# EasyEDA Pro project p4-mipi-v1.0.eprj

# Schematic Schematic1
Board Name: Board1; Create Date: 2025-06-03; Page Name: P1; Project Name: p4-mipi-v1.0; Schematic Name: Schematic1; Update Date: 2025-06-03; Company: EasyEDA.com; Page Size: A4; Version: V1.0
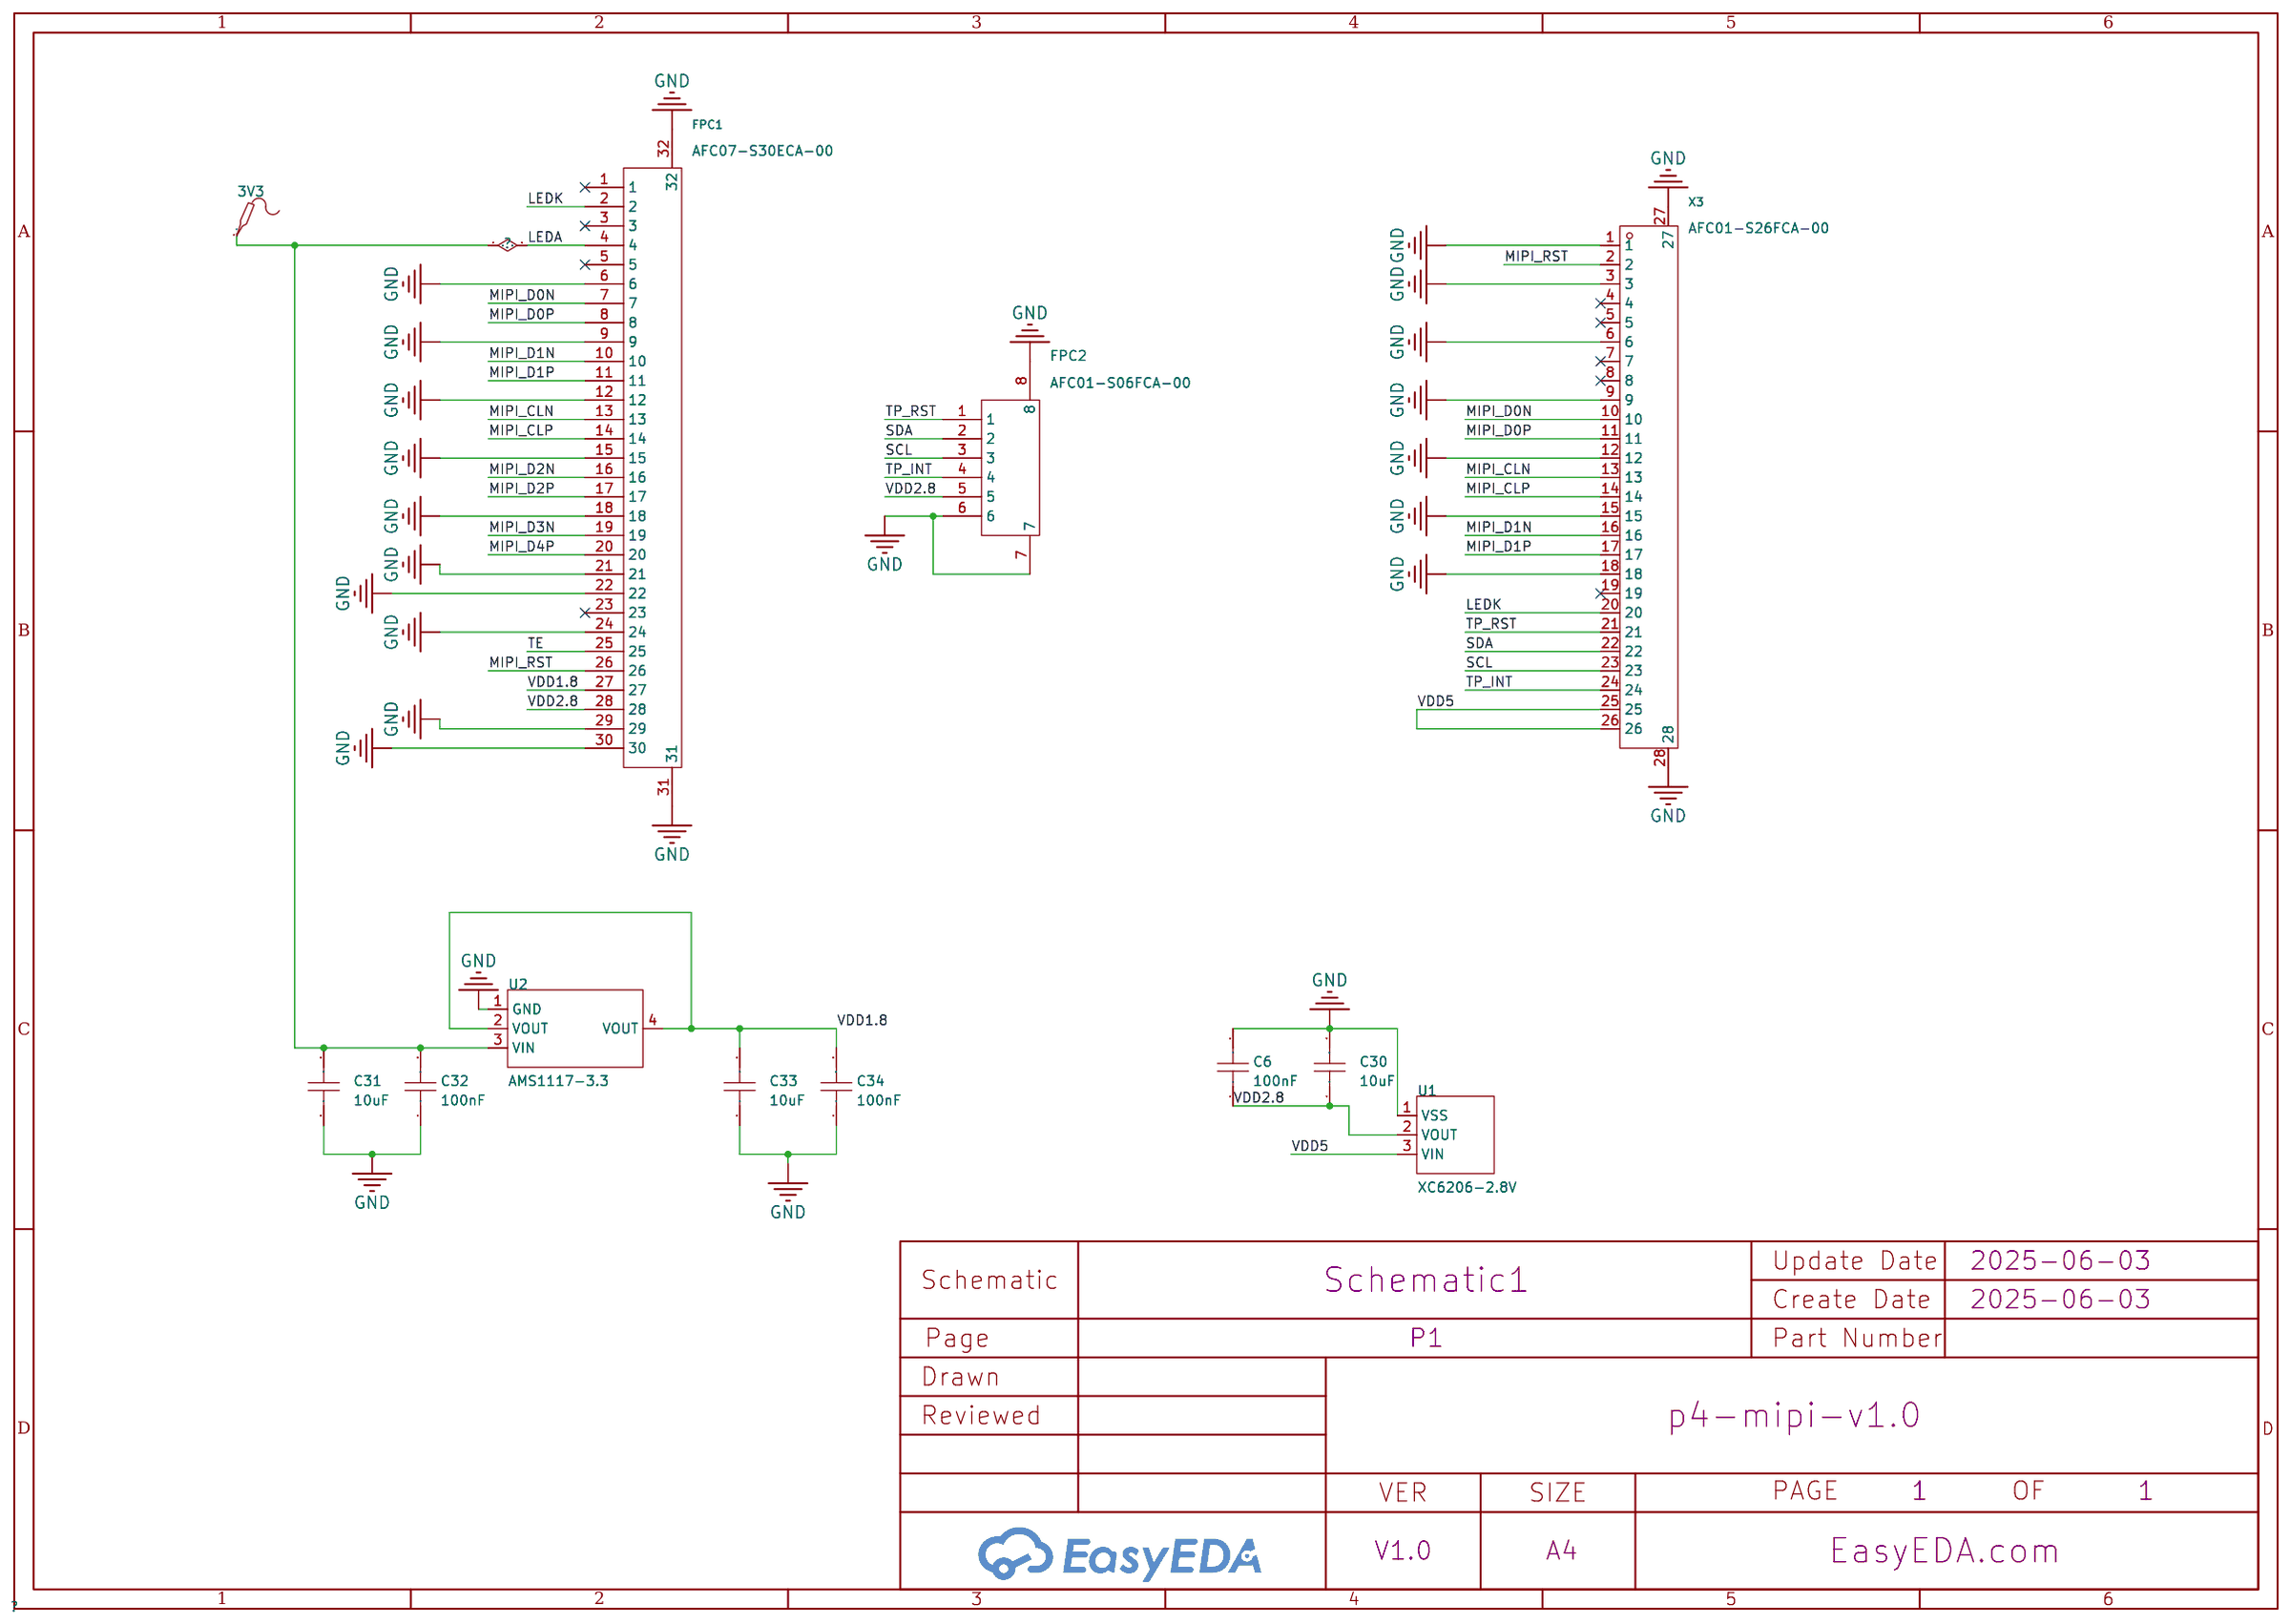
[diagram p0: schematic sheet]

## Parts
3V3  -  [Test-Point-0.5mm]
C6  100nF  [C0402]
C30  10uF  [C0603]
C31  10uF  [C0603]
C32  100nF  [C0402]
C33  10uF  [C0603]
C34  100nF  [C0402]
FPC1  AFC07-S30ECA-00  [FPC-SMD_P0.50-30P_LCS-SJ-H2.0]
FPC2  AFC01-S06FCA-00  [FPC-SMD_P0.50-6P_AFC01-S06FCA-00]
U1  XC6206-2.8V  [SOT-23-3_L2.9-W1.6-P1.90-LS2.8-BR]
U2  AMS1117-3.3  [SOT-223-3_L6.5-W3.4-P2.30-LS7.0-BR]
X3  AFC01-S26FCA-00  [FPC-SMD_AFC01-S26FCA-00]

## Library data of the parts
3V3 = Test-Point
C6 C32 C34 = CL05A105KA5NQNC: Capacitance: Tolerance:±10% Tolerance:±10% Voltage Rated: Temperature Coefficient:; LCSC Part Name: 1uF ±10% 25V; Supplier Part: C52923; Manufacturer: SAMSUNG(三星); Supplier Footprint: 0402; JLCPCB Part Class: Basic Part; Datasheet: https://atta.szlcsc.com/upload/public/pdf/source/20160218/1457707763339.pdf; Supplier: LCSC; Tolerance: ±10%
C30 C31 C33 = CGA0603X5R106K100JT: Capacitance:10uF Tolerance:±10% Tolerance:±10% Voltage Rating:10V Temperature Coefficient:X5R; LCSC Part Name: 10uF ±10% 10V; Supplier Part: C6119842; Manufacturer: HRE(芯声); Supplier Footprint: 0603; JLCPCB Part Class: Extended Part; Supplier: LCSC; Tolerance: ±10%; Voltage Rating: 10V; Temperature Coefficient: X5R
FPC1 = AFC07-S30ECA-00: LCSC Part Name: 间距:0.5mm P数:30P 抽屉式 上接; Supplier Part: C262645; Manufacturer: JS(钜硕电子); Supplier Footprint: SMD,P=0.5mm,卧贴; JLCPCB Part Class: Extended Part; Datasheet: https://atta.szlcsc.com/upload/public/pdf/source/20190726/C11082_A2E7B12387019CE4314BB5199EE0FDF4.pdf; Supplier: LCSC; Locking Feature: 抽屉式; Contact Type: Contact,Top; Number of Contacts: 30P; Pitch: 0.5mm; Mounting Type: 卧贴; FFC, FCB Thickness: 0.3mm; Height Above Board: 2mm
FPC2 = AFC01-S06FCA-00: LCSC Part Name: 间距:0.5mm P数:6P 翻盖式 下接; Supplier Part: C262655; Manufacturer: JS(钜硕电子); Supplier Footprint: SMD,P=0.5mm,卧贴; JLCPCB Part Class: Extended Part; Datasheet: https://atta.szlcsc.com/upload/public/pdf/source/20190816/C413942_2A72D1AC756EAE17EEDF756A339D4500.pdf; Supplier: LCSC; Locking Feature: Clamshell; Contact Type: Bottom Contact; Number of Contacts: 6P; Pitch: 0.5mm; Mounting Type: 卧贴; FFC, FCB Thickness: 0.3mm; Height Above Board: 2mm
U1 = XC6206-2.8V: LCSC Part Name: 输入6V 输出2.8V 250mA; Supplier Part: C2892669; Manufacturer: YONGYUTAI(永裕泰); Supplier Footprint: SOT-23-3L; JLCPCB Part Class: Extended Part; Datasheet: https://atta.szlcsc.com/upload/public/pdf/source/20210901/DE3C77F0CE73FFE8F7C655BE9B94CB06.pdf; Supplier: LCSC; Output Type: Fixed; Voltage - Supply: 6V; Output Voltage: 2.8V; Output Current: 250mA; Features: Short-Circuit  Protection(SCP)；Low ESR；Overcurrent Protection(OCP); Operating Temperature: -40℃~+85℃@(Tj); Output Configuration: Positive electrode; Number of Outputs: 1
U2 = AMS1117-3.3_C6186: LCSC Part Name: 输出3.3V 1A; Supplier Part: C6186; Manufacturer: AMS; Supplier Footprint: SOT-223; Datasheet: https://atta.szlcsc.com/upload/public/pdf/source/20180727/C6186_7A095716F0823C02F1997A905E26C086.pdf; Supplier: LCSC; Output Type: Fixed; Output Voltage: 3.3V; Output Current: 1A; Power Supply Rejection Ratio (PSRR): 72dB@(120Hz); Voltage Dropout: 1.3V@(800mA); Features: Overcurrent Protection(OCP)；热关断(TSD); Output Configuration: Positive electrode; Number of Outputs: 1
X3 = AFC01-S26FCA-00: LCSC Part Name: 间距:0.5mm P数:26P 翻盖式 下接; Supplier Part: C262670; Manufacturer: JS(钜硕电子); Supplier Footprint: SMD,P=0.5mm,卧贴; JLCPCB Part Class: Extended Part; Datasheet: https://atta.szlcsc.com/upload/public/pdf/source/20191211/C262677_316A580FEA155B8CDF2AB479F4C1B0B5.pdf; Supplier: LCSC; Locking Feature: Clamshell; Contact Type: Bottom Contact; Number of Contacts: 26P; Pitch: 0.5mm; Mounting Type: 卧贴; FFC, FCB Thickness: 0.3mm; Height Above Board: 2mm

## Nets
GND: C6.2 C30.2 C31.1 C32.1 C33.1 C34.1 FPC1.6 FPC1.9 FPC1.12 FPC1.15 FPC1.18 FPC1.21 FPC1.22 FPC1.24 FPC1.29 FPC1.30 FPC1.31 FPC1.32 FPC2.6 FPC2.7 FPC2.8 U1.1(VSS) U2.1(GND) X3.1 X3.3 X3.6 X3.9 X3.12 X3.15 X3.18 X3.27 X3.28
VDD1.8: C33.2 C34.2 FPC1.27 U2.2(VOUT) U2.4(VOUT)
VDD2.8: C6.1 C30.1 FPC1.28 FPC2.5 U1.2(VOUT)
VDD5: U1.3(VIN) X3.25 X3.26
LEDA: 3V3.1 C31.2 C32.2 FPC1.4 U2.3(VIN)
LEDK: FPC1.2 X3.20
MIPI_CLN: FPC1.13 X3.13
MIPI_CLP: FPC1.14 X3.14
MIPI_D0N: FPC1.7 X3.10
MIPI_D0P: FPC1.8 X3.11
MIPI_D1N: FPC1.10 X3.16
MIPI_D1P: FPC1.11 X3.17
MIPI_D2N: FPC1.16
MIPI_D2P: FPC1.17
MIPI_D3N: FPC1.19
MIPI_D4P: FPC1.20
MIPI_RST: FPC1.26 X3.2
SCL: FPC2.3 X3.23
SDA: FPC2.2 X3.22
TE: FPC1.25
TP_INT: FPC2.4 X3.24
TP_RST: FPC2.1 X3.21

Not connected (* = marked no-connect by the designer): FPC1 1* 3* 5* 23*; X3 4* 5* 7* 8* 19*

# Schematic Schematic2
Board Name: Board2; Create Date: 2025-07-01; Page Name: P1; Project Name: p4-mipi-v1.0; Schematic Name: Schematic2; Update Date: 2025-07-01; Company: EasyEDA.com; Page Size: A4; Version: V1.0
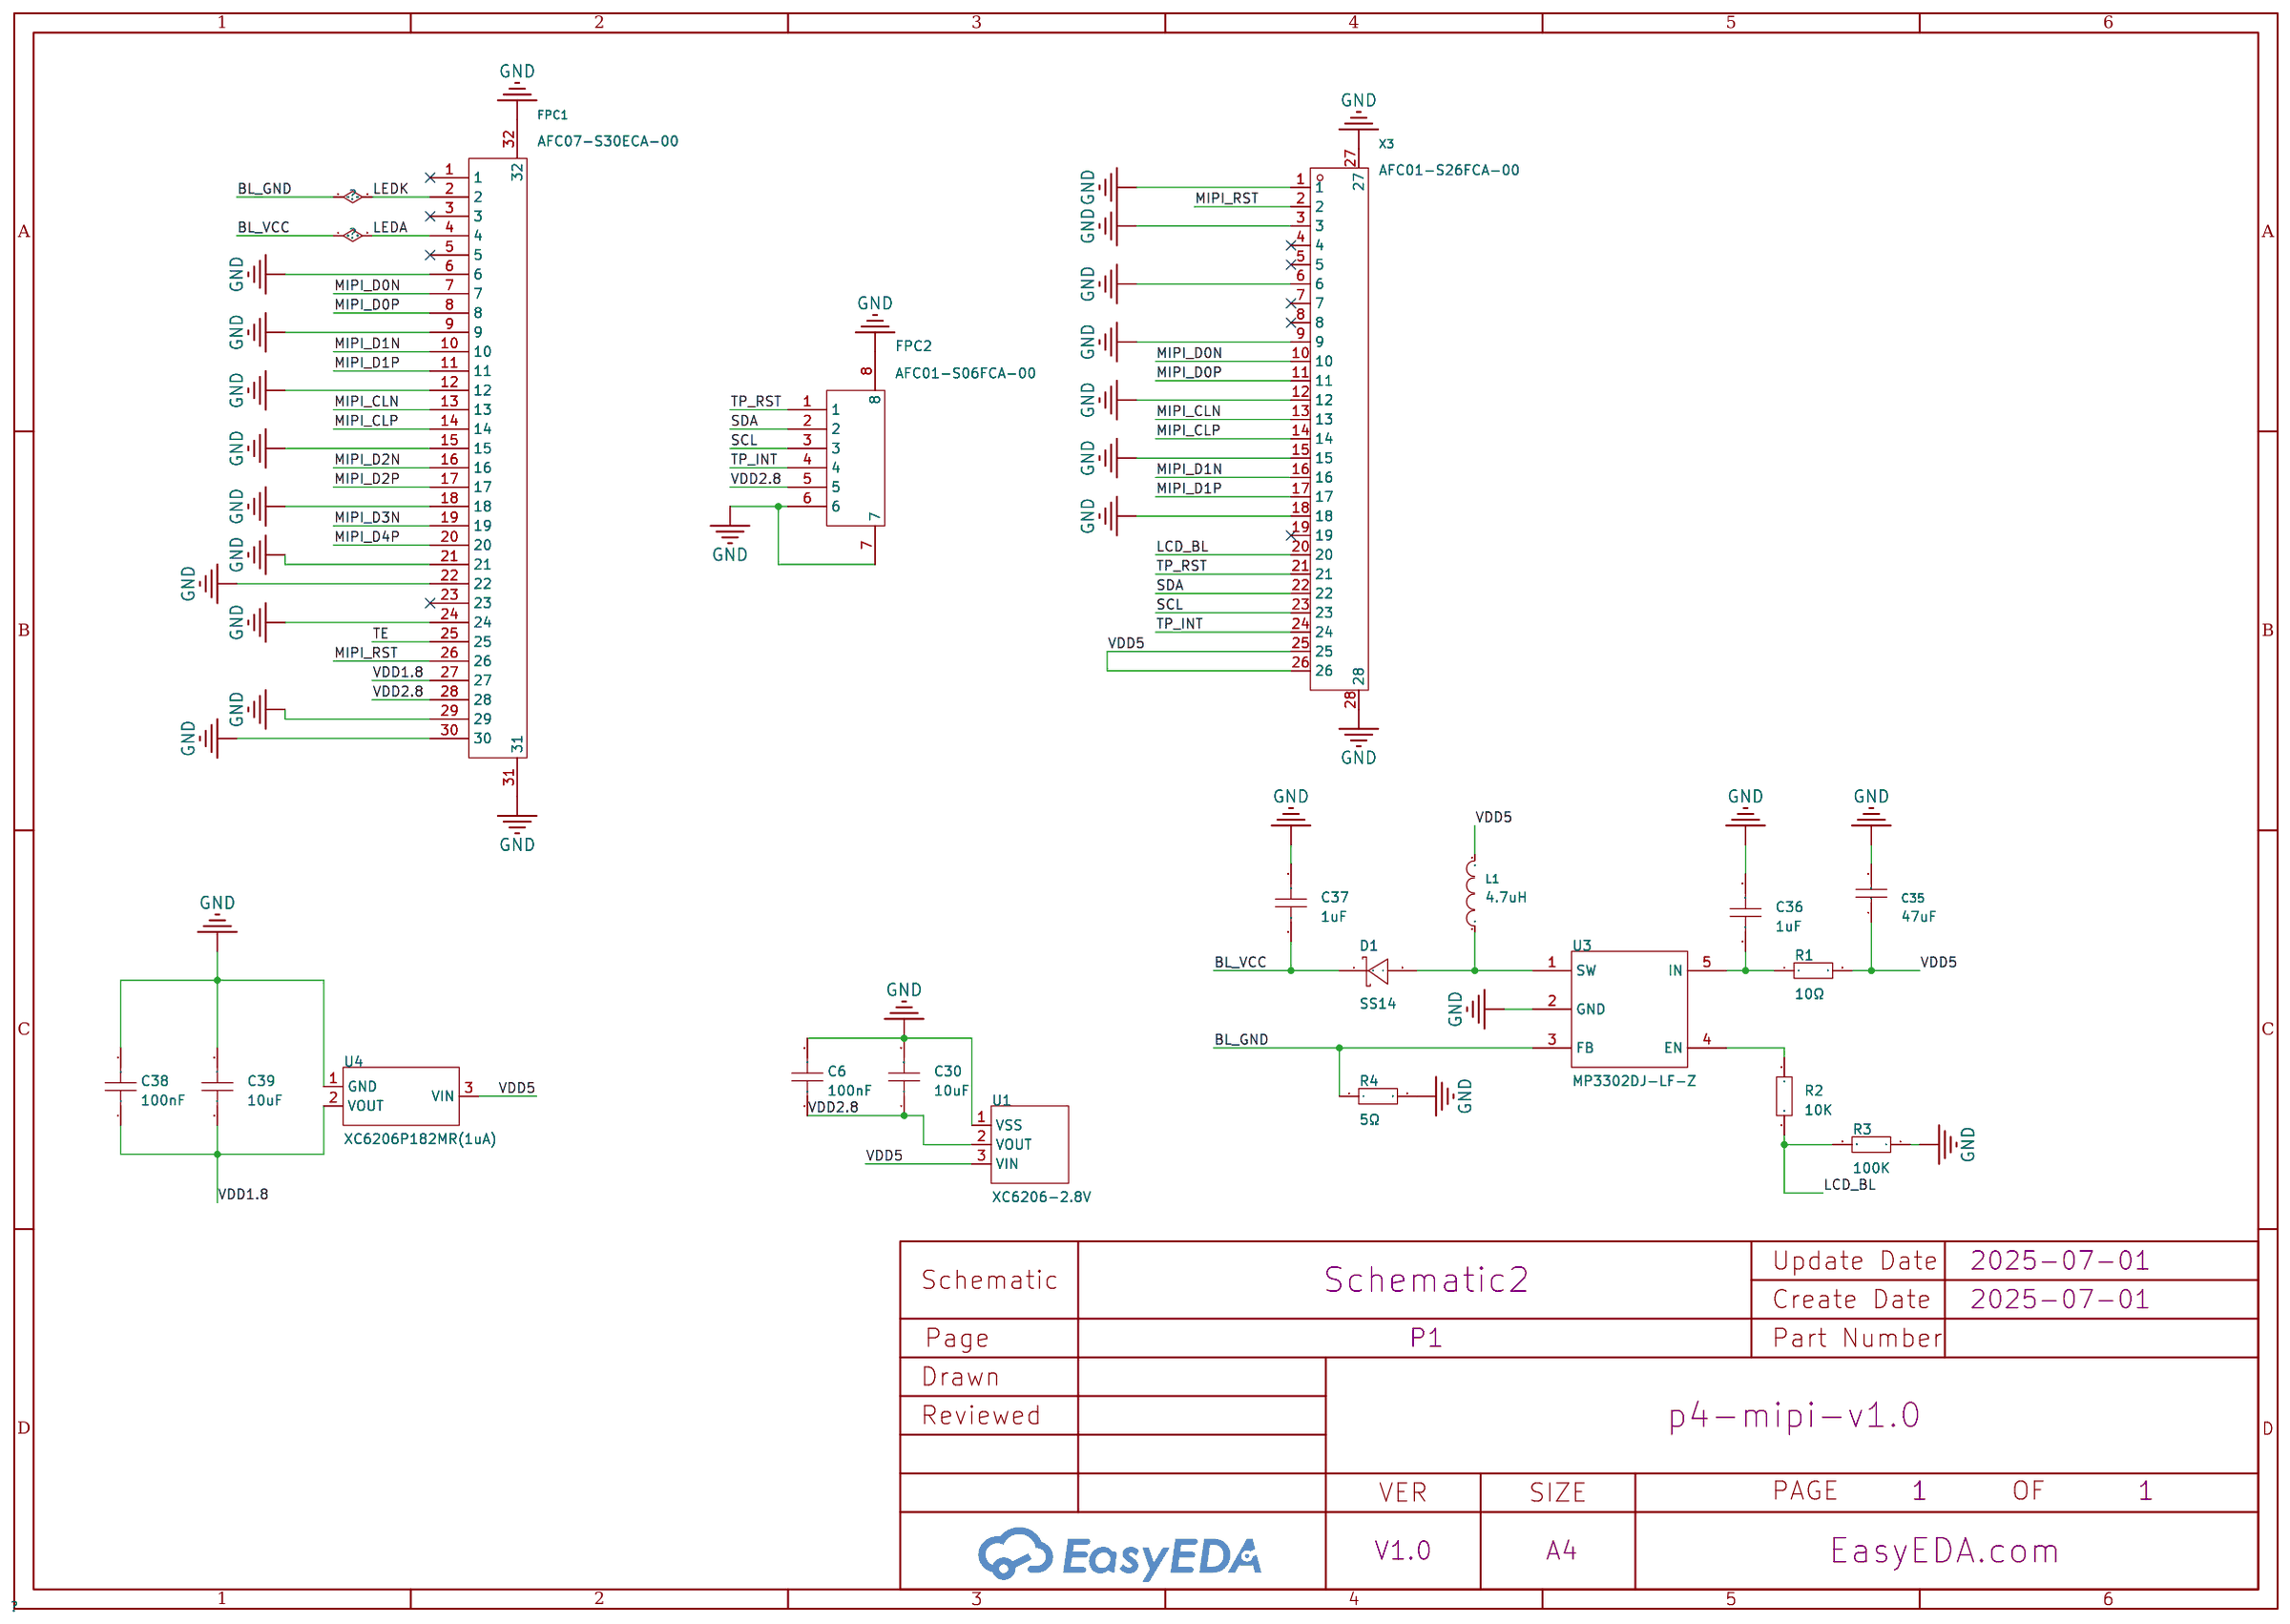
[diagram p1: schematic sheet]

## Parts
C6  100nF  [C0402]
C30  10uF  [C0603]
C35  47uF  [C0603]
C36  1uF  [C0603]
C37  1uF  [C0603]
C38  100nF  [C0402]
C39  10uF  [C0603]
D1  SS14  [SMA_L4.3-W2.6-LS5.2-RD]
FPC1  AFC07-S30ECA-00  [FPC-SMD_P0.50-30P_LCS-SJ-H2.0]
FPC2  AFC01-S06FCA-00  [FPC-SMD_P0.50-6P_AFC01-S06FCA-00]
L1  4.7uH  [IND-SMD_L4.4-W4.2]
R1  10Ω  [R0402]
R2  10K  [R0402]
R3  100K  [R0402]
R4  5Ω  [R0402]
U1  XC6206-2.8V  [SOT-23-3_L2.9-W1.6-P1.90-LS2.8-BR]
U3  MP3302DJ-LF-Z  [SOT-23-5_L3.0-W1.7-P0.95-LS2.8-BR]
U4  XC6206P182MR(1uA)  [SOT-23-3_L2.9-W1.6-P1.90-LS2.8-BR]
X3  AFC01-S26FCA-00  [FPC-SMD_AFC01-S26FCA-00]

## Library data of the parts
C6 C38 = CL05A105KA5NQNC: Capacitance: Tolerance:±10% Tolerance:±10% Voltage Rated: Temperature Coefficient:; LCSC Part Name: 1uF ±10% 25V; Supplier Part: C52923; Manufacturer: SAMSUNG(三星); Supplier Footprint: 0402; JLCPCB Part Class: Basic Part; Datasheet: https://atta.szlcsc.com/upload/public/pdf/source/20160218/1457707763339.pdf; Supplier: LCSC; Tolerance: ±10%
C30 C39 = CGA0603X5R106K100JT: Capacitance:10uF Tolerance:±10% Tolerance:±10% Voltage Rating:10V Temperature Coefficient:X5R; LCSC Part Name: 10uF ±10% 10V; Supplier Part: C6119842; Manufacturer: HRE(芯声); Supplier Footprint: 0603; JLCPCB Part Class: Extended Part; Supplier: LCSC; Tolerance: ±10%; Voltage Rating: 10V; Temperature Coefficient: X5R
C35 = GRM188R60J476ME15D: LCSC Part Name: 47uF ±20% 6.3V; Supplier Part: C140782; Manufacturer: muRata(村田); Supplier Footprint: 0603; JLCPCB Part Class: Extended Part; Datasheet: https://atta.szlcsc.com/upload/public/pdf/source/20171113/C140782_15105612981581115778.pdf; Supplier: LCSC; Tolerance: ±20%
C36 C37 = CL10A105KB8NNNC: LCSC Part Name: 1uF ±10% 50V; Supplier Part: C15849; Manufacturer: SAMSUNG(三星); Supplier Footprint: 0603; JLCPCB Part Class: Basic Part; Datasheet: https://atta.szlcsc.com/upload/public/pdf/source/20160218/1457707763339.pdf; Supplier: LCSC; Tolerance: ±10%
D1 = SS14_C83852: LCSC Part Name: 电压:40V 电流:1A; Supplier Part: C83852; Manufacturer: onsemi(安森美); Supplier Footprint: SMA(DO-214AC); JLCPCB Part Class: Extended Part; Datasheet: https://atta.szlcsc.com/upload/public/pdf/source/20181222/C83852_041FE29A925F1DAA7D9CB1F1C69076C2.pdf; Supplier: LCSC; Forward Voltage (Vf@If): 500mV@1A; Reverse Voltage (Vr): 40V; Rectified Current: 1A; Reverse Leakage Current (Ir): 200uA@40V
FPC1 = AFC07-S30ECA-00: LCSC Part Name: 间距:0.5mm P数:30P 抽屉式 上接; Supplier Part: C262645; Manufacturer: JS(钜硕电子); Supplier Footprint: SMD,P=0.5mm,卧贴; JLCPCB Part Class: Extended Part; Datasheet: https://atta.szlcsc.com/upload/public/pdf/source/20190726/C11082_A2E7B12387019CE4314BB5199EE0FDF4.pdf; Supplier: LCSC; Locking Feature: 抽屉式; Contact Type: Contact,Top; Number of Contacts: 30P; Pitch: 0.5mm; Mounting Type: 卧贴; FFC, FCB Thickness: 0.3mm; Height Above Board: 2mm
FPC2 = AFC01-S06FCA-00: LCSC Part Name: 间距:0.5mm P数:6P 翻盖式 下接; Supplier Part: C262655; Manufacturer: JS(钜硕电子); Supplier Footprint: SMD,P=0.5mm,卧贴; JLCPCB Part Class: Extended Part; Datasheet: https://atta.szlcsc.com/upload/public/pdf/source/20190816/C413942_2A72D1AC756EAE17EEDF756A339D4500.pdf; Supplier: LCSC; Locking Feature: Clamshell; Contact Type: Bottom Contact; Number of Contacts: 6P; Pitch: 0.5mm; Mounting Type: 卧贴; FFC, FCB Thickness: 0.3mm; Height Above Board: 2mm
L1 = SLO0420H4R7MTT: LCSC Part Name: 4.7uH ±20%; Supplier Part: C207830; Manufacturer: Sunltech(韩国顺磁); Supplier Footprint: SMD; JLCPCB Part Class: Extended Part; Datasheet: https://atta.szlcsc.com/upload/public/pdf/source/20180412/C207832_AC02695E18CA38D7B5E2858AA75468CE.pdf; Supplier: LCSC; Tolerance: ±20%
R1-R4 = RC0402FR-0710RL: LCSC Part Name: 厚膜电阻 10Ω ±1% 62.5mW; Supplier Part: C138066; Manufacturer: YAGEO(国巨); Supplier Footprint: 0402; JLCPCB Part Class: Extended Part; Datasheet: https://atta.szlcsc.com/upload/public/pdf/source/20181009/C309620_DA5935B6E1D48212CB7A533FE518B3C2.pdf; Supplier: LCSC; Type: Thick Film Resistors; Tolerance: ±1%; Temperature Coefficient: ±200ppm/℃; Operating Temperature Range: -55℃~+155℃
U1 = XC6206-2.8V: LCSC Part Name: 输入6V 输出2.8V 250mA; Supplier Part: C2892669; Manufacturer: YONGYUTAI(永裕泰); Supplier Footprint: SOT-23-3L; JLCPCB Part Class: Extended Part; Datasheet: https://atta.szlcsc.com/upload/public/pdf/source/20210901/DE3C77F0CE73FFE8F7C655BE9B94CB06.pdf; Supplier: LCSC; Output Type: Fixed; Voltage - Supply: 6V; Output Voltage: 2.8V; Output Current: 250mA; Features: Short-Circuit  Protection(SCP)；Low ESR；Overcurrent Protection(OCP); Operating Temperature: -40℃~+85℃@(Tj); Output Configuration: Positive electrode; Number of Outputs: 1
U3 = MP3302DJ-LF-Z: Supplier Part: C15035; Manufacturer: MPS(芯源); Supplier Footprint: TSOT-23-5; JLCPCB Part Class: Extended Part; Datasheet: https://atta.szlcsc.com/upload/public/pdf/source/20240514/2E39C2A006245A2119E00EF19DA2BC3B.pdf; Supplier: LCSC; Type: DC-DCVoltage Stabilizer; Input Voltage: 2.5V~6V; Switch Frequency: 1.3MHz; Channels: 1; Output Voltage: 36V; Output Current: 1.33A; Dimming: Single Wire; Topology: boost converter; Operating temperature: -40℃~+125℃
U4 = XC6206P182MR(1uA): Supplier Part: C2827651; Manufacturer: TECH PUBLIC(台舟); Supplier Footprint: SOT-23-3L; JLCPCB Part Class: Extended Part; Datasheet: https://atta.szlcsc.com/upload/public/pdf/source/20210427/C2827651_CB3194A7C09679308DE708B038C8109A.pdf; Supplier: LCSC; Output Type: Fixed; Output Voltage: 1.8V; Output Current: 200mA; standby current: 1uA; Features: Overcurrent Protection(OCP)；过热关断(TSD)(OTP); Output Configuration: Positive electrode; Number of Outputs: 1
X3 = AFC01-S26FCA-00: LCSC Part Name: 间距:0.5mm P数:26P 翻盖式 下接; Supplier Part: C262670; Manufacturer: JS(钜硕电子); Supplier Footprint: SMD,P=0.5mm,卧贴; JLCPCB Part Class: Extended Part; Datasheet: https://atta.szlcsc.com/upload/public/pdf/source/20191211/C262677_316A580FEA155B8CDF2AB479F4C1B0B5.pdf; Supplier: LCSC; Locking Feature: Clamshell; Contact Type: Bottom Contact; Number of Contacts: 26P; Pitch: 0.5mm; Mounting Type: 卧贴; FFC, FCB Thickness: 0.3mm; Height Above Board: 2mm

## Nets
GND: C6.2 C30.2 C35.2 C36.2 C37.2 C38.2 C39.2 FPC1.6 FPC1.9 FPC1.12 FPC1.15 FPC1.18 FPC1.21 FPC1.22 FPC1.24 FPC1.29 FPC1.30 FPC1.31 FPC1.32 FPC2.6 FPC2.7 FPC2.8 R3.1 R4.2 U1.1(VSS) U3.2(GND) U4.1(GND) X3.1 X3.3 X3.6 X3.9 X3.12 X3.15 X3.18 X3.27 X3.28
VDD1.8: C38.1 C39.1 FPC1.27 U4.2(VOUT)
VDD2.8: C6.1 C30.1 FPC1.28 FPC2.5 U1.2(VOUT)
VDD5: C35.1 L1.2 R1.2 U1.3(VIN) U4.3(VIN) X3.25 X3.26
BL_GND: FPC1.2 R4.1 U3.3(FB)
BL_VCC: C37.1 D1.1(K) FPC1.4
LCD_BL: R2.1 R3.2 X3.20
MIPI_CLN: FPC1.13 X3.13
MIPI_CLP: FPC1.14 X3.14
MIPI_D0N: FPC1.7 X3.10
MIPI_D0P: FPC1.8 X3.11
MIPI_D1N: FPC1.10 X3.16
MIPI_D1P: FPC1.11 X3.17
MIPI_D2N: FPC1.16
MIPI_D2P: FPC1.17
MIPI_D3N: FPC1.19
MIPI_D4P: FPC1.20
MIPI_RST: FPC1.26 X3.2
SCL: FPC2.3 X3.23
SDA: FPC2.2 X3.22
TE: FPC1.25
TP_INT: FPC2.4 X3.24
TP_RST: FPC2.1 X3.21
$1N1393: C36.1 R1.1 U3.5(IN)
$1N1536: R2.2 U3.4(EN)
$1N1811: D1.2(A) L1.1 U3.1(SW)

Not connected (* = marked no-connect by the designer): FPC1 1* 3* 5* 23*; X3 4* 5* 7* 8* 19*

# Board PCB1
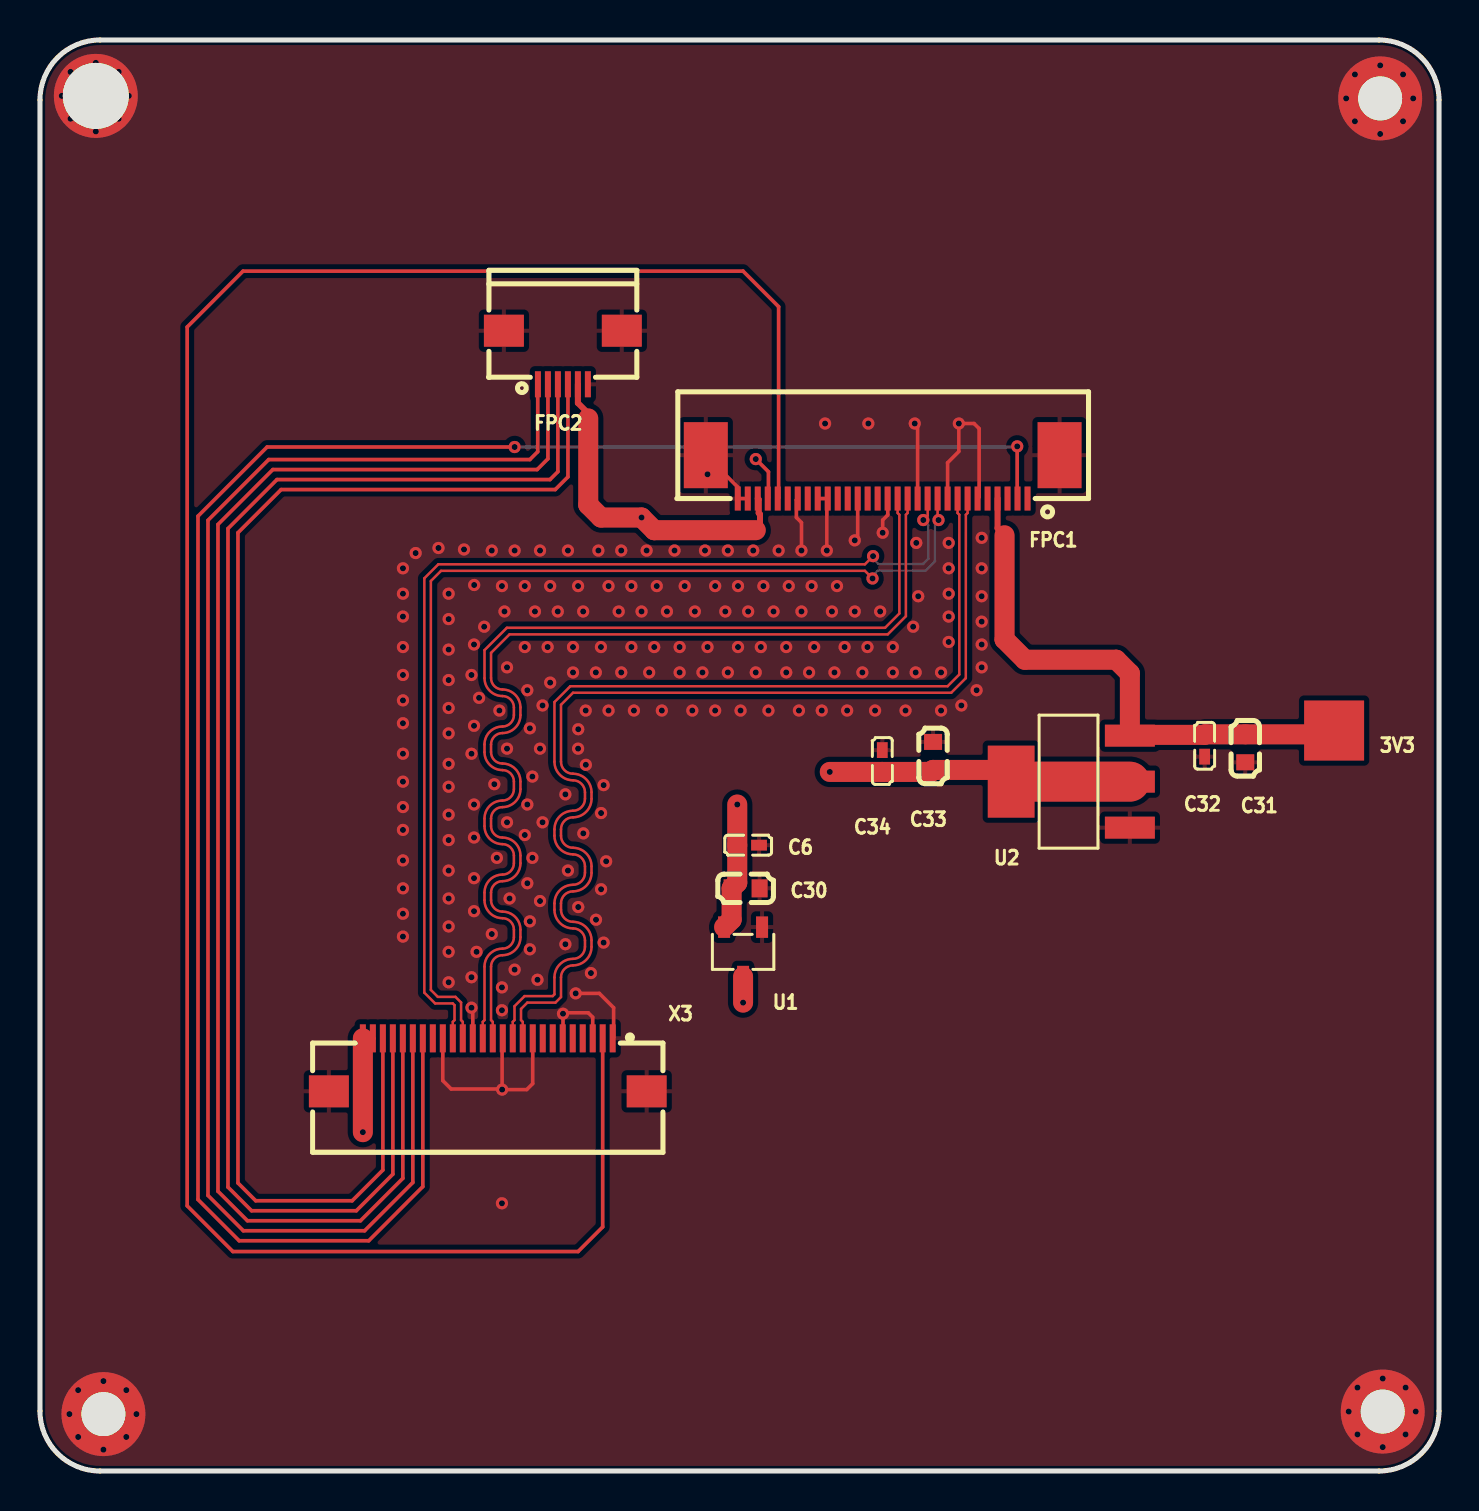
[diagram p2: board, top side]
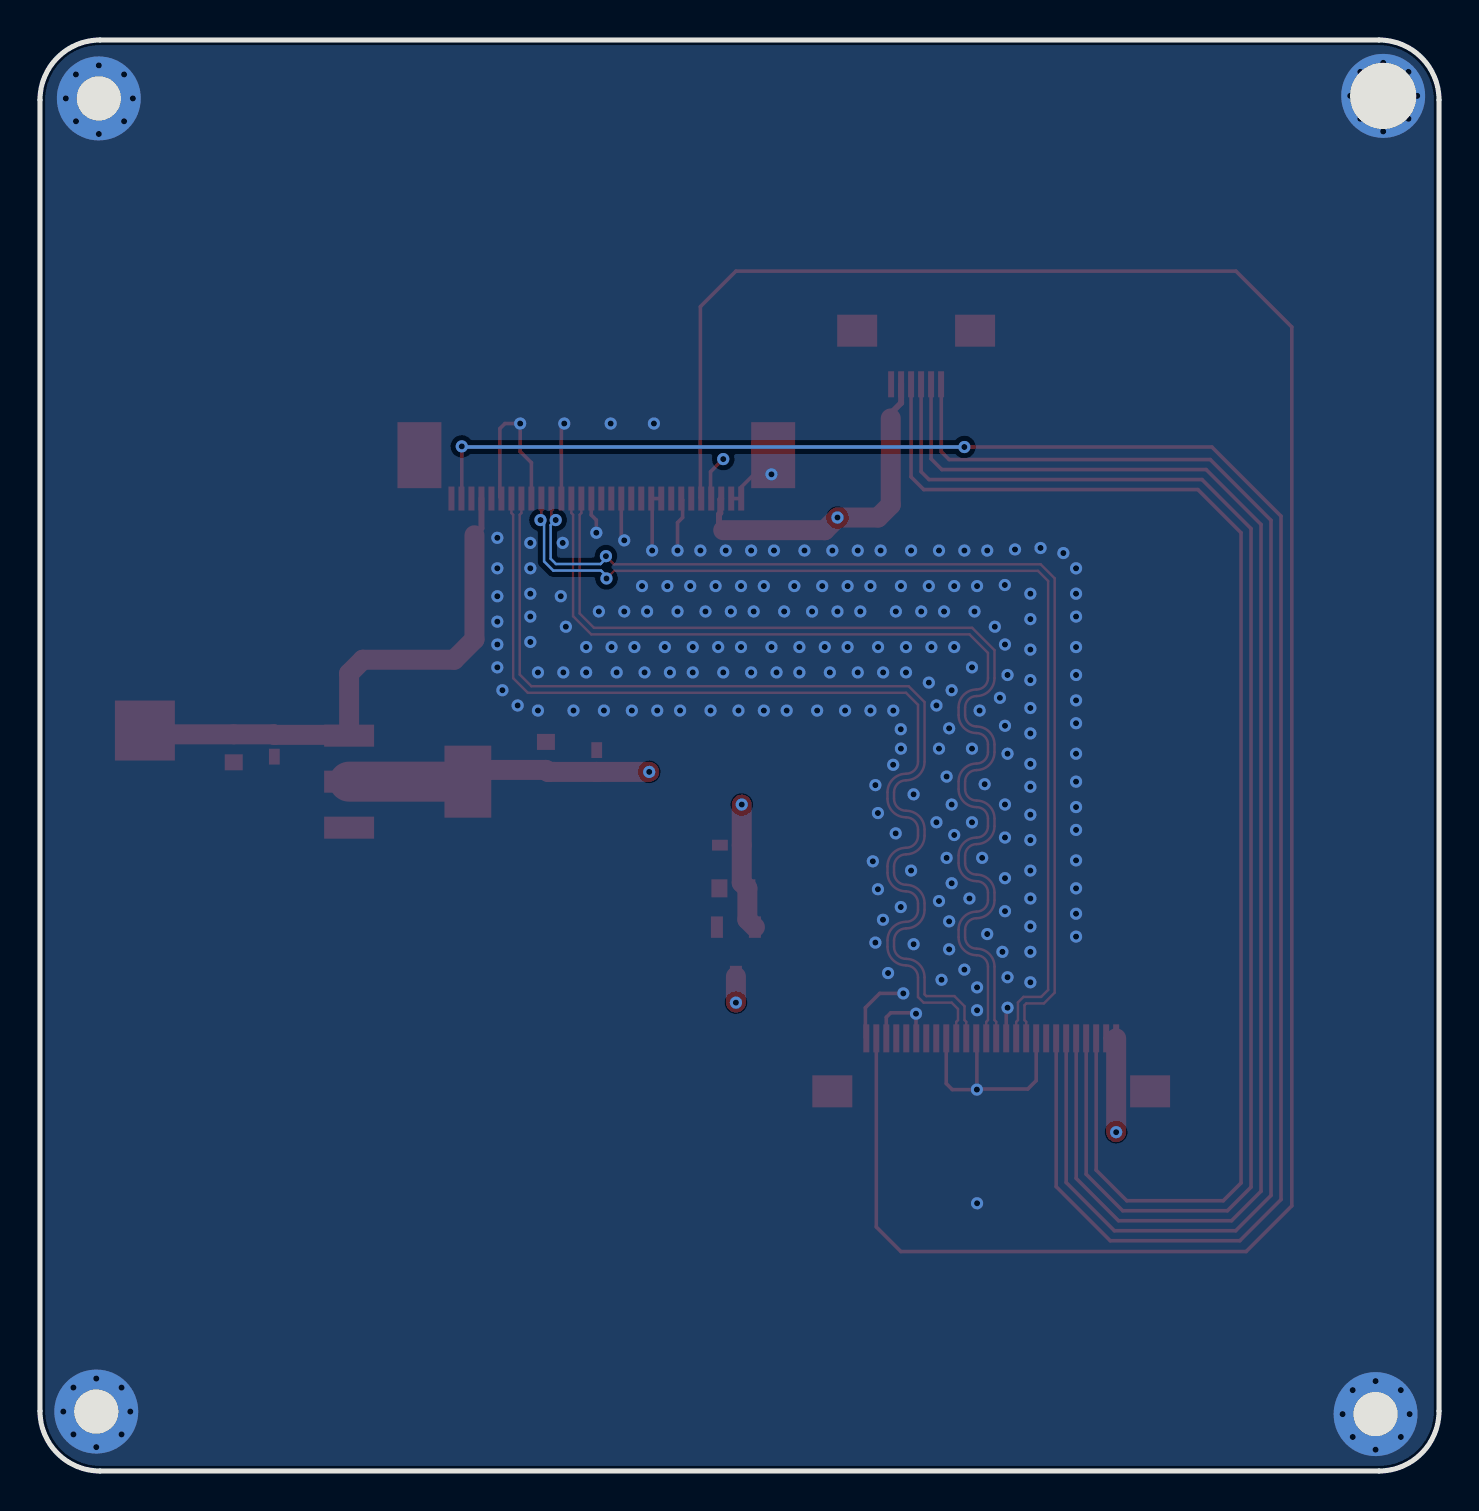
[diagram p3: board, bottom side, seen from below]

Outline 70 x 71.55 mm; copper layers: Top Layer, GND, PWR, Bottom Layer. Coordinates in mm from the lower left corner of the outline.
Outline path: 0,68.55 0,3 arc(0.88,0.88) 3,0 67,0 arc(69.12,0.88) 70,3 70,68.55 arc(69.12,70.67) 67,71.55 3,71.55 arc(0.88,70.67) 0,68.55
Stack: Top Layer 0.035mm Outer layer copper thickness 1oz / Dielectric1 0.2104mm 7628 RC49% 8.6mil / GND 0.0152mm Inner layer copper thickness / Dielectric2 1.065mm 1.1mm H/HOZ Copper / PWR 0.0152mm Inner layer copper thickness / Dielectric3 0.2104mm 7628 RC49% 8.6mil / Bottom Layer 0.035mm Outer layer copper thickness 1oz

## Design rules (mm)
net MIPI_D0N: DP1
net MIPI_D0P: DP1
net MIPI_D1N: DP2
net MIPI_D1P: DP2
net MIPI_CLN: DP3
net MIPI_CLP: DP3
template: Custom Config
spacing copperThickness1oz (default): track to track 0.102, other pairs 0.152 to 0.3
spacing copperThickness2oz: track to track 0.203, other pairs 0.152 to 0.3
track width copperThickness1oz (default): min 0.127, default 0.18, max 2.54
track width copperThickness2oz: min 0.203, default 0.254, max 2.54
differential pair differentialPair (default): width min 0.124, default 0.124, max 0.124; gap min 0.203, default 0.203
via viaSize (default): diameter min 0.5, default 0.61, max 10; hole min 0.3, default 0.305, max 6.3

## Placement (name value [footprint] x y rotation side)
3V3  -  [Test-Point-0.5mm]  64.75 37.02 270 top
C6  100nF  [C0402]  35.43 31.29 0 top
C30  10uF  [C0603]  35.31 29.13 0 top
C31  10uF  [C0603]  60.31 36.14 90 top
C32  100nF  [C0402]  58.27 36.26 90 top
C33  10uF  [C0603]  44.68 35.75 270 top
C34  100nF  [C0402]  42.14 35.5 270 top
FPC1  AFC07-S30ECA-00  [FPC-SMD_P0.50-30P_LCS-SJ-H2.0]  42.16 49.71 0 top
FPC2  AFC01-S06FCA-00  [FPC-SMD_P0.50-6P_AFC01-S06FCA-00]  26.16 55.68 180 top
NOREF  -  [Pad_e1970]  2.79 68.76 0 top
NOREF#2  -  [Pad_e1983]  67.06 68.63 0 top
NOREF#3  -  [Pad_e1992]  67.18 2.97 0 top
NOREF#4  -  [Pad_e2001]  3.17 2.84 0 top
U1  XC6206-2.8V  [SOT-23-3_L2.9-W1.6-P1.90-LS2.8-BR]  35.18 25.96 90 top
U2  AMS1117-3.3  [SOT-223-3_L6.5-W3.4-P2.30-LS7.0-BR]  51.56 34.47 0 top
X3  AFC01-S26FCA-00  [FPC-SMD_AFC01-S26FCA-00]  22.4 20.31 0 top

## Footprints (pads in the part's own frame, mm; a bottom-side part is the same pattern mirrored in y, then rotated)
C0402
  rect 0.79x0.54 smd: 1(-0.545,0) 2(0.545,0)
C0603
  rect 0.8x0.9 smd: 1(-0.7,0) 2(0.7,0)
FPC-SMD_AFC01-S26FCA-00
  rect 0.3x1.4 smd: 1(6.25,1.325) 2(5.75,1.325) 3(5.25,1.325) 4(4.75,1.325) 5(4.25,1.325) 6(3.75,1.325) 7(3.25,1.325) 8(2.75,1.325) 9(2.25,1.325) 10(1.75,1.325) 11(1.25,1.325) 12(0.75,1.325) 13(0.25,1.325) 14(-0.25,1.325) 15(-0.75,1.325) 16(-1.25,1.325) 17(-1.75,1.325) 18(-2.25,1.325) 19(-2.75,1.325) 20(-3.25,1.325) 21(-3.75,1.325) 22(-4.25,1.325) 23(-4.75,1.325) 24(-5.25,1.325) 25(-5.75,1.325) 26(-6.25,1.325)
  rect 2x1.6 smd: 27(-7.95,-1.325) 28(7.95,-1.325)
FPC-SMD_P0.50-6P_AFC01-S06FCA-00
  rect 0.3x1.3 smd: 1(1.248,1.339) 2(0.748,1.339) 3(0.248,1.339) 4(-0.252,1.339) 5(-0.752,1.339) 6(-1.252,1.339)
  rect 2x1.6 smd: 7(2.95,-1.339) 8(-2.95,-1.339)
FPC-SMD_P0.50-30P_LCS-SJ-H2.0
  rect 0.3x1.2 smd: 1(7.248,-1.083) 2(6.748,-1.083) 3(6.248,-1.083) 4(5.748,-1.083) 5(5.248,-1.083) 6(4.748,-1.083) 7(4.248,-1.083) 8(3.748,-1.083) 9(3.248,-1.083) 10(2.748,-1.083) 11(2.248,-1.083) 12(1.748,-1.083) 13(1.248,-1.083) 14(0.748,-1.083) 15(0.248,-1.083) 16(-0.252,-1.083) 17(-0.752,-1.083) 18(-1.25,-1.085) 19(-1.75,-1.085) 20(-2.25,-1.085) 21(-2.75,-1.085) 22(-3.25,-1.085) 23(-3.75,-1.085) 24(-4.25,-1.085) 25(-4.75,-1.085) 26(-5.25,-1.085) 27(-5.75,-1.085) 28(-6.25,-1.085) 29(-6.75,-1.085) 30(-7.25,-1.085)
  rect 2.2x3.3 smd: 31(8.85,1.085) 32(-8.85,1.085)
Pad_e1970
  round 4.2 hole 3.3x2.2: 1(0,0)
Pad_e1983
  round 4.2 hole 2.2: 1(0,0)
Pad_e1992
  round 4.2 hole 2.2: 1(0,0)
Pad_e2001
  round 4.2 hole 2.2: 1(0,0)
SOT-23-3_L2.9-W1.6-P1.90-LS2.8-BR
  rect 1.07x0.6 smd: 1(1.235,-0.95) 2(1.235,0.95) 3(-1.235,0)
SOT-223-3_L6.5-W3.4-P2.30-LS7.0-BR
  rect 2.5x1.1 smd: 1(2.97,-2.3) 2(2.97,0) 3(2.97,2.3)
  rect 2.34x3.6 smd: 4(-2.97,0)
Test-Point-0.5mm
  rect 3x3 smd: 1(0,0)

## Nets
As in the schematic, except:
GND: C6.2 C30.2 C31.1 C32.1 C33.1 C34.1 FPC1.6 FPC1.9 FPC1.12 FPC1.15 FPC1.18 FPC1.21 FPC1.22 FPC1.24 FPC1.29 FPC1.30 FPC1.31 FPC1.32 FPC2.6 FPC2.7 FPC2.8 NOREF.1 NOREF#2.1 NOREF#3.1 NOREF#4.1 U1.1 U2.1 X3.1 X3.3 X3.6 X3.9 X3.12 X3.15 X3.18 X3.27 X3.28

Pads without a net: FPC1 1 3 5 23; X3 4 5 7 8 19

## Via types
v1: diameter 0.61, hole 0.305, Top Layer to Bottom Layer, 246 vias

## Routing (per net, layer and track width the routed paths; a pad name or vN(x,y) marks a point on that pad's centre or on a via; arc(x,y) is an arc through that point)
GND: length 46.5
  Top Layer w0.18: v1(40.77,46.53) 40.91,46.68 FPC1.18 ; v1(23.12,19.07) 24.35,19.07 24.65,19.37 X3.9 ; v1(23.12,19.07) 23.09,19.1 20.57,19.1 20.15,19.52 X3.18 ; v1(23.12,19.07) 23.12,21.6 X3.12 ; v1(39.37,46.02) 39.37,48.58 FPC1.21 FPC1.22 ; X3.15 21.65,23.1 v1(21.59,23.16) ; X3.1 28.7,21.68 28.7,23.16 27.99,23.88 v1(26.8,23.88) ; FPC1.12 43.91,52.23 v1(43.77,52.38) ; FPC1.6 46.99,48.7 46.99,52.12 46.74,52.38 v1(45.97,52.38) 45.97,50.98 45.41,50.42 FPC1.9 ; FPC1.32 34.91,49.19 FPC1.30 FPC1.29 ; X3.6 26.17,21.65 v1(26.17,22.86) 26.22,22.91 27.43,22.91 27.65,22.69 X3.3 ; v1(42.16,46.91) 42.16,47.55 42.42,47.8 42.42,48.62 FPC1.15 ; FPC1.24 37.85,48.55 37.85,47.68 38.1,47.42 v1(38.1,46.02)
  vias: v1(1.09,68.76) v1(1.47,2.84) v1(1.53,69.96) v1(1.53,67.61) v1(1.91,4.04) v1(1.91,1.7) v1(2.79,70.41) v1(2.79,66.98) v1(3.17,4.5) v1(3.17,1.07) v1(3.94,69.96) v1(3.94,67.61) v1(4.32,4.04) v1(4.32,1.7) v1(4.44,68.76) v1(4.83,2.84) v1(18.16,45.14) v1(18.16,43.87) v1(18.16,42.72) v1(18.16,41.2) v1(18.16,39.8) v1(18.16,38.53) v1(18.16,37.39) v1(18.16,35.86) v1(18.16,34.47) v1(18.16,33.2) v1(18.16,32.05) v1(18.16,30.53) v1(18.16,29.13) v1(18.16,27.86) v1(18.16,26.72) v1(18.8,45.9) v1(19.94,46.15) v1(20.45,43.87) v1(20.45,42.6) v1(20.45,41.07) v1(20.45,39.55) v1(20.45,38.15) v1(20.45,36.88) v1(20.45,35.36) v1(20.45,34.21) v1(20.45,32.82) v1(20.45,31.55) v1(20.45,30.02) v1(20.45,28.63) v1(20.45,27.23) v1(20.45,25.96) v1(20.45,24.44) v1(21.22,46.08) v1(21.59,39.8) v1(21.59,35.86) v1(21.59,24.69) v1(21.72,44.3) v1(21.72,41.33) v1(21.72,37.26) v1(21.72,33.32) v1(21.72,31.67) v1(21.72,29.64) v1(21.72,27.99) v1(21.84,25.96) v1(21.97,38.66) v1(22.23,42.21) v1(22.61,46.02) v1(22.61,26.85) v1(22.73,34.34) v1(22.86,30.66) v1(22.99,38.02) v1(23.11,44.25) v1(23.11,24.18) v1(23.11,23.04) v1(23.11,13.39) v1(23.24,42.98) v1(23.37,40.18) v1(23.37,36.12) v1(23.37,32.44) v1(23.49,28.63) v1(23.75,46.02) v1(23.75,25.07) v1(24.26,44.25) v1(24.26,41.2) v1(24.26,31.8) v1(24.38,39.04) v1(24.38,33.32) v1(24.38,29.39) v1(24.51,37.13) v1(24.51,27.48) v1(24.51,26.09) v1(24.64,34.72) v1(24.64,30.66) v1(24.77,42.98) v1(24.89,24.56) v1(25.02,46.02) v1(25.02,36.12) v1(25.02,28.5) v1(25.15,38.28) v1(25.15,32.44) v1(25.4,41.2) v1(25.53,44.25) v1(25.53,39.42) v1(25.91,42.98) v1(26.29,33.83) v1(26.29,26.34) v1(26.42,46.02) v1(26.42,30.02) v1(26.67,41.2) v1(26.67,39.93) v1(26.92,44.25) v1(26.93,37.09) v1(26.92,36.12) v1(26.93,28.2) v1(27.18,42.98) v1(27.19,31.88) v1(27.3,38.02) v1(27.31,35.31) v1(27.57,24.9) v1(27.81,39.93) v1(27.82,27.56) v1(27.94,46.02) v1(28.07,41.2) v1(28.07,32.9) v1(28.07,29.09) v1(28.2,34.3) v1(28.2,26.42) v1(28.33,30.48) v1(28.45,44.25) v1(28.45,38.02) v1(28.96,42.98) v1(29.08,46.02) v1(29.08,39.93) v1(29.59,44.25) v1(29.59,41.2) v1(29.72,38.02) v1(30.1,42.98) v1(30.35,46.02) v1(30.48,39.93) v1(30.73,41.2) v1(30.86,44.25) v1(31.11,38.02) v1(31.37,42.98) v1(31.75,46.02) v1(32,41.2) v1(32,39.93) v1(32.26,44.25) v1(32.64,38.02) v1(32.77,42.98) v1(33.15,39.93) v1(33.27,46.02) v1(33.4,49.83) v1(33.4,41.2) v1(33.78,44.25) v1(33.78,38.02) v1(34.29,42.98) v1(34.42,46.02) v1(34.42,39.93) v1(34.92,44.25) v1(34.92,41.2) v1(35.05,38.02) v1(35.43,42.98) v1(35.69,46.02) v1(35.81,39.93) v1(36.07,41.2) v1(36.2,44.25) v1(36.45,38.02) v1(36.7,42.98) v1(36.96,46.02) v1(37.34,41.2) v1(37.34,39.93) v1(37.46,44.25) v1(37.97,38.02) v1(38.1,42.98) v1(38.48,39.93) v1(38.61,44.25) v1(38.73,41.2) v1(39.12,38.02) v1(39.28,52.38) v1(39.62,42.98) v1(39.75,39.93) v1(39.88,44.25) v1(40.26,41.2) v1(40.39,38.02) v1(40.77,42.98) v1(41.15,39.93) v1(41.45,52.38) v1(41.4,41.2) v1(41.78,38.02) v1(42.04,42.98) v1(42.67,41.2) v1(42.67,39.93) v1(43.31,38.02) v1(43.69,42.21) v1(43.84,46.41) v1(43.81,39.93) v1(43.94,43.74) v1(45.08,39.93) v1(45.08,38.02) v1(45.47,46.41) v1(45.47,45.14) v1(45.47,43.87) v1(45.47,42.72) v1(45.47,41.45) v1(46.1,38.28) v1(46.86,39.04) v1(47.12,46.66) v1(47.12,45.14) v1(47.12,43.74) v1(47.12,42.47) v1(47.12,41.33) v1(47.12,40.18) v1(65.35,68.63) v1(65.48,2.97) v1(65.79,69.83) v1(65.79,67.49) v1(65.92,4.17) v1(65.92,1.83) v1(67.06,70.28) v1(67.06,66.85) v1(67.18,4.62) v1(67.18,1.19) v1(68.2,69.83) v1(68.2,67.49) v1(68.33,4.17) v1(68.33,1.83) v1(68.71,68.63) v1(68.83,2.97)
VDD1.8: length 74.5
  Top Layer w0.18: v1(35.81,50.6) 36.45,49.96 36.45,48.66 FPC1.27
  Top Layer w1: v1(39.52,34.96) 44.59,34.96 C33.2 48.01,35.05 U2.4
  Top Layer w2: U2.2 U2.4
  PWR w1: v1(39.52,34.96) 39.52,36.01 40.01,36.5 54.99,36.5 56.64,38.15 56.64,52.38 55.5,53.52 36.7,53.52 35.81,52.63 v1(35.81,50.6)
VDD2.8: length 103.3
  Top Layer w0.3: 35.81,47.04 36.03,47.25 36.03,47.83 35.96,47.9 35.96,48.57 FPC1.28 ; 27.43,52.88 26.91,53.4 FPC2.5
  Top Layer w1: 35.81,47.04 30.73,47.04 v1(30.1,47.68) 28.07,47.68 27.43,48.31 27.43,52.63 ; v1(34.89,33.32) C6.1 34.89,29.42 C30.1 34.61,27.57 U1.2
  PWR w1: v1(34.89,33.32) 57.4,33.32 58.55,34.47 58.55,54.79 57.4,55.93 32.39,55.93 30.1,53.64 v1(30.1,47.68)
VDD5: length 31.6
  Top Layer w0.3: X3.25 X3.26
  Top Layer w1: X3.26 v1(16.15,16.94) ; v1(35.18,23.42) U1.3
  PWR w1: v1(35.18,23.42) 35.18,17.58 34.54,16.94 v1(16.15,16.94)
LEDA: length 27.6
  Top Layer w0.3: FPC1.4 47.91,47.13 48.26,46.79
  Top Layer w1: 48.26,46.79 48.26,41.58 49.28,40.56 53.85,40.56 54.53,39.88 54.53,36.77 54.57,36.81 C32.2 58.3,36.84 C31.2 64.56,36.84 3V3.1
LEDK: length 99.9
  Top Layer w0.18: v1(48.89,51.23) 48.89,48.64 FPC1.2 ; X3.20 19.15,14.22 16.45,11.51 9.97,11.51 7.91,13.57 7.91,47.74 11.36,51.2 v1(23.75,51.2)
  Bottom Layer w0.18: v1(23.75,51.2) 48.86,51.2 v1(48.89,51.23)
MIPI_CLN: length 53.5
  Top Layer w0.124: FPC1.13 43.41,47.9 43.33,47.81 43.33,42.74 42.42,41.83 23.49,41.83 22.57,40.91 22.57,39.65 arc(22.74,39.24) 23.14,39.08 arc(23.78,38.81) 24.04,38.18 24.04,37.8 arc(23.78,37.16) 23.14,36.9 arc(22.74,36.73) 22.57,36.33 22.57,35.95 arc(22.74,35.54) 23.14,35.37 arc(23.78,35.11) 24.04,34.47 24.04,34.09 arc(23.78,33.46) 23.14,33.2 arc(22.74,33.03) 22.57,32.62 22.57,32.24 arc(22.74,31.84) 23.14,31.67 arc(23.78,31.41) 24.04,30.77 24.04,30.39 arc(23.78,29.76) 23.14,29.49 arc(22.74,29.33) 22.57,28.92 22.57,28.54 arc(22.74,28.14) 23.14,27.97 arc(23.78,27.71) 24.04,27.07 24.04,26.69 arc(23.78,26.05) 23.14,25.79 arc(22.74,25.62) 22.57,25.22 22.57,22.54 22.65,22.46 X3.13
MIPI_CLP: length 53.5
  Top Layer w0.124: X3.14 22.15,22.46 22.24,22.54 22.24,25.22 arc(22.5,25.85) 23.14,26.12 arc(23.54,26.29) 23.71,26.69 23.71,27.07 arc(23.54,27.47) 23.14,27.64 arc(22.5,27.91) 22.24,28.54 22.24,28.92 arc(22.5,29.56) 23.14,29.82 arc(23.54,29.99) 23.71,30.39 23.71,30.77 arc(23.54,31.18) 23.14,31.34 arc(22.5,31.61) 22.24,32.24 22.24,32.62 arc(22.5,33.26) 23.14,33.52 arc(23.54,33.69) 23.71,34.09 23.71,34.47 arc(23.54,34.88) 23.14,35.05 arc(22.5,35.31) 22.24,35.95 22.24,36.33 arc(22.5,36.96) 23.14,37.22 arc(23.54,37.39) 23.71,37.8 23.71,38.18 arc(23.54,38.58) 23.14,38.75 arc(22.5,39.01) 22.24,39.65 22.24,41.04 23.36,42.16 42.28,42.16 43,42.88 43,47.81 42.91,47.9 FPC1.14
MIPI_D0N: length 53.4
  Top Layer w0.124: X3.10 24.15,22.46 24.07,22.54 24.07,23.1 24.38,23.42 25.79,23.42 26.07,23.7 26.07,24.68 arc(26.24,25.1) 26.67,25.28 arc(27.32,25.55) 27.6,26.21 27.6,26.53 arc(27.32,27.19) 26.67,27.46 arc(26.24,27.63) 26.07,28.06 26.07,28.38 arc(26.24,28.81) 26.67,28.98 arc(27.32,29.25) 27.6,29.91 27.6,30.23 arc(27.32,30.89) 26.67,31.16 arc(26.24,31.34) 26.07,31.76 26.07,32.09 arc(26.24,32.51) 26.67,32.69 arc(27.32,32.96) 27.6,33.61 27.6,33.94 arc(27.32,34.59) 26.67,34.86 arc(26.24,35.04) 26.07,35.46 26.07,38.31 26.67,38.91 45.59,38.91 46.32,39.64 46.33,47.81 46.41,47.9 FPC1.7
MIPI_D0P: length 53.4
  Top Layer w0.124: X3.11 23.65,22.46 23.74,22.54 23.74,23.24 24.25,23.75 25.65,23.75 25.74,23.83 25.74,24.68 arc(26.01,25.34) 26.67,25.61 arc(27.09,25.78) 27.27,26.21 27.27,26.53 arc(27.09,26.96) 26.67,27.13 arc(26.01,27.4) 25.74,28.06 25.74,28.38 arc(26.01,29.04) 26.67,29.31 arc(27.09,29.49) 27.27,29.91 27.27,30.23 arc(27.09,30.66) 26.67,30.83 arc(26.01,31.11) 25.74,31.76 25.74,32.09 arc(26.01,32.74) 26.67,33.01 arc(27.09,33.19) 27.27,33.61 27.27,33.94 arc(27.09,34.36) 26.67,34.54 arc(26.01,34.81) 25.74,35.46 25.74,38.45 26.53,39.24 45.41,39.24 46,39.82 46,47.81 45.91,47.9 FPC1.8
MIPI_D1N: length 53.3
  Top Layer w0.124: FPC1.10 44.91,47.59 v1(44.96,47.55) ; v1(41.66,44.63) 41.27,45.01 20.07,45.01 19.56,44.5 19.56,24.05 19.9,23.71 20.79,23.71 21.07,23.43 21.07,22.54 21.15,22.46 X3.16
  Bottom Layer w0.124: v1(41.66,44.63) 41.66,44.75 41.92,45.02 44.32,45.02 44.78,45.48 44.78,47.37 v1(44.96,47.55)
MIPI_D1P: length 53.4
  Top Layer w0.124: v1(44.2,47.55) 44.42,47.77 44.42,48.62 FPC1.11 ; v1(41.68,45.74) 41.27,45.34 19.93,45.34 19.23,44.64 19.23,23.92 19.77,23.38 20.65,23.38 20.74,23.29 20.74,22.54 20.65,22.46 X3.17
  Bottom Layer w0.124: v1(44.2,47.55) 44.45,47.3 44.45,45.62 44.18,45.35 41.95,45.35 41.68,45.62 v1(41.68,45.74)
MIPI_RST: length 116.7
  Top Layer w0.18: FPC1.26 36.96,48.67 36.96,58.22 35.18,59.99 10.16,59.99 7.37,57.2 7.37,13.26 9.65,10.97 26.92,10.97 28.15,12.2 X3.2
SCL: length 71.3
  Top Layer w0.18: X3.23 17.65,14.84 15.83,13.01 10.59,13.01 9.41,14.19 9.41,47.12 11.86,49.57 25.52,49.57 25.91,49.97 FPC2.3
SDA: length 72.7
  Top Layer w0.18: X3.22 18.15,14.63 16.04,12.51 10.38,12.51 8.91,13.99 8.91,47.33 11.65,50.07 24.88,50.07 25.41,50.61 FPC2.2
TP_INT: length 69.6
  Top Layer w0.18: FPC2.4 26.42,54.34 26.42,49.71 25.78,49.07 12.06,49.07 9.91,46.91 9.91,14.4 10.8,13.51 15.62,13.51 17.15,15.05 X3.24
TP_RST: length 74.2
  Top Layer w0.18: X3.21 18.65,14.43 16.24,12.01 10.17,12.01 8.41,13.78 8.41,47.54 11.44,50.57 24.51,50.57 24.9,50.97 24.9,54.33 FPC2.1

## Copper pours and planes (outline as drawn; the poured copper is in the pictures)
GND on Top Layer: -3.3,74.73 77.98,74.73 77.98,-5.03 -3.3,-5.03
GND on Bottom Layer: -5.21,74.98 76.07,74.98 76.07,-4.78 -5.21,-4.78
GND on GND: -5.96,76.36 75.32,76.36 75.32,-3.4 -5.96,-3.4
GND on PWR: -6.98,74.73 74.3,74.73 74.3,-5.03 -6.98,-5.03

# Board PCB2
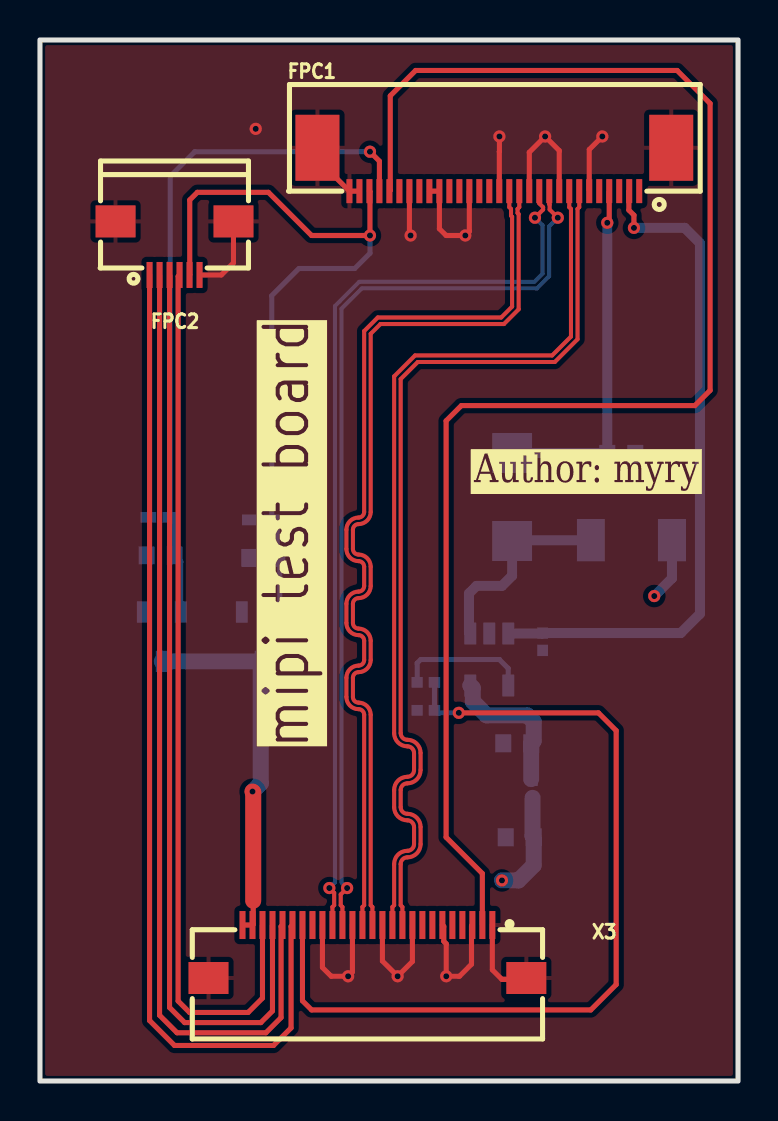
[diagram p4: board, top side]
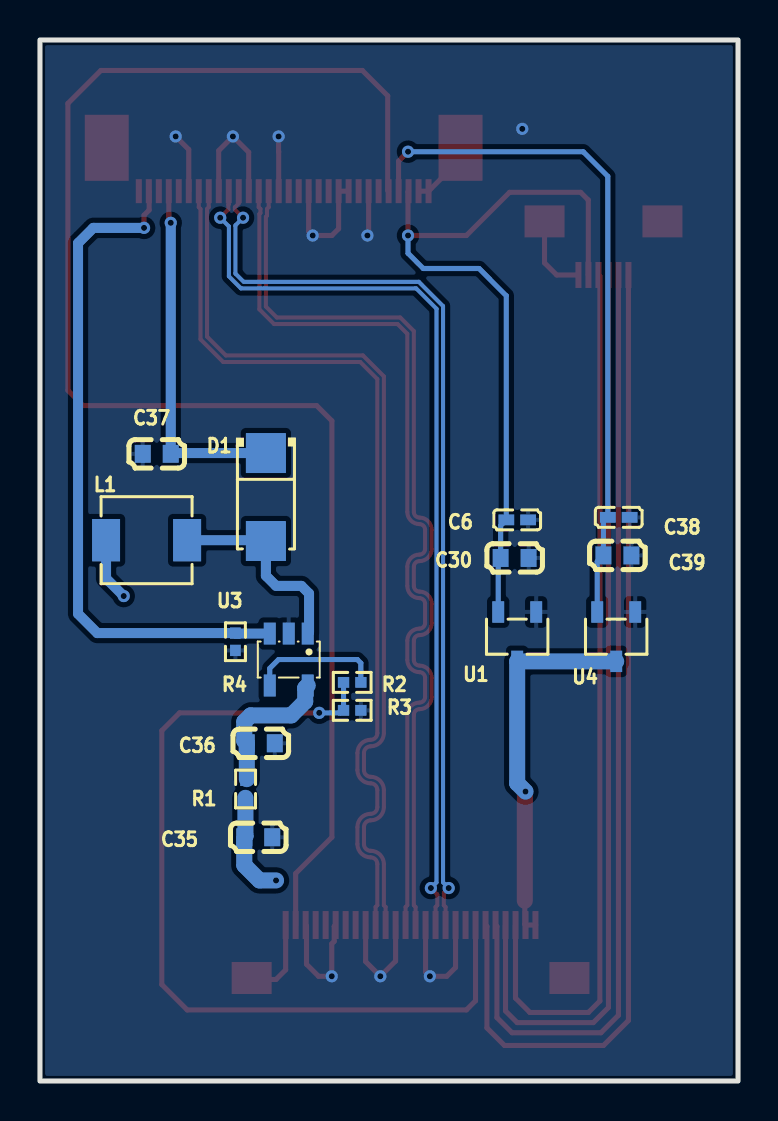
[diagram p5: board, bottom side, seen from below]

Outline 34.92 x 52.07 mm; copper layers: Top Layer, GND, PWR, Bottom Layer. Coordinates in mm from the lower left corner of the outline.
Outline path: rectangle 0,52.07 34.92,0
Stack: Top Layer 0.035mm Outer layer copper thickness 1oz / Dielectric1 0.2104mm 7628 RC49% 8.6mil / GND 0.0152mm Inner layer copper thickness / Dielectric2 1.065mm 1.1mm H/HOZ Copper / PWR 0.0152mm Inner layer copper thickness / Dielectric3 0.2104mm 7628 RC49% 8.6mil / Bottom Layer 0.035mm Outer layer copper thickness 1oz

## Design rules (mm)
net MIPI_D0N: DP1
net MIPI_D0P: DP1
net MIPI_D1N: DP4
net MIPI_D1P: DP4
net MIPI_CLN: DP2
net MIPI_CLP: DP2
net MIPI_D2N: DP3
net MIPI_D2P: DP3
template: Custom Config
spacing copperThickness1oz (default): track to track 0.102, other pairs 0.152 to 0.3
spacing copperThickness2oz: track to track 0.203, other pairs 0.152 to 0.3
track width copperThickness1oz (default): min 0.127, default 0.254, max 2.54
track width copperThickness2oz: min 0.203, default 0.254, max 2.54
differential pair differentialPair (default): width min 0.203, default 0.203, max 0.203; gap min 0.124, default 0.124
via viaSize (default): diameter min 0.5, default 0.61, max 10; hole min 0.3, default 0.305, max 6.3

## Placement (name value [footprint] x y rotation side)
C6  100nF  [C0402]  11.05 28.07 180 bottom
C30  10uF  [C0603]  11.18 26.16 180 bottom
C35  47uF  [C0603]  24 12.19 180 bottom
C36  1uF  [C0603]  23.88 16.89 180 bottom
C37  1uF  [C0603]  29.08 31.37 0 bottom
C38  100nF  [C0402]  5.97 28.19 180 bottom
C39  10uF  [C0603]  6.04 26.29 180 bottom
D1  SS14  [SMA_L4.3-W2.6-LS5.2-RD]  23.62 29.21 270 bottom
FPC1  AFC07-S30ECA-00  [FPC-SMD_P0.50-30P_LCS-SJ-H2.0]  22.73 45.59 0 top
FPC2  AFC01-S06FCA-00  [FPC-SMD_P0.50-6P_AFC01-S06FCA-00]  6.73 41.66 180 top
L1  4.7uH  [IND-SMD_L4.4-W4.2]  29.59 27.05 180 bottom
R1  10Ω  [R0402]  24.64 14.61 270 bottom
R2  10K  [R0402]  19.3 19.94 180 bottom
R3  100K  [R0402]  19.3 18.54 0 bottom
R4  5Ω  [R0402]  25.15 21.97 270 bottom
U1  XC6206-2.8V  [SOT-23-3_L2.9-W1.6-P1.90-LS2.8-BR]  11.05 22.23 90 bottom
U3  MP3302DJ-LF-Z  [SOT-23-5_L3.0-W1.7-P0.95-LS2.8-BR]  22.48 21.08 90 bottom
U4  XC6206P182MR(1uA)  [SOT-23-3_L2.9-W1.6-P1.90-LS2.8-BR]  6.1 22.23 90 bottom
X3  AFC01-S26FCA-00  [FPC-SMD_AFC01-S26FCA-00]  16.38 6.48 0 top

## Footprints (pads in the part's own frame, mm; a bottom-side part is the same pattern mirrored in y, then rotated)
C0402
  rect 0.79x0.54 smd: 1(-0.545,0) 2(0.545,0)
C0603
  rect 0.8x0.9 smd: 1(-0.7,0) 2(0.7,0)
FPC-SMD_AFC01-S26FCA-00
  rect 0.3x1.4 smd: 1(6.25,1.325) 2(5.75,1.325) 3(5.25,1.325) 4(4.75,1.325) 5(4.25,1.325) 6(3.75,1.325) 7(3.25,1.325) 8(2.75,1.325) 9(2.25,1.325) 10(1.75,1.325) 11(1.25,1.325) 12(0.75,1.325) 13(0.25,1.325) 14(-0.25,1.325) 15(-0.75,1.325) 16(-1.25,1.325) 17(-1.75,1.325) 18(-2.25,1.325) 19(-2.75,1.325) 20(-3.25,1.325) 21(-3.75,1.325) 22(-4.25,1.325) 23(-4.75,1.325) 24(-5.25,1.325) 25(-5.75,1.325) 26(-6.25,1.325)
  rect 2x1.6 smd: 27(-7.95,-1.325) 28(7.95,-1.325)
FPC-SMD_P0.50-6P_AFC01-S06FCA-00
  rect 0.3x1.3 smd: 1(1.248,1.339) 2(0.748,1.339) 3(0.248,1.339) 4(-0.252,1.339) 5(-0.752,1.339) 6(-1.252,1.339)
  rect 2x1.6 smd: 7(2.95,-1.339) 8(-2.95,-1.339)
FPC-SMD_P0.50-30P_LCS-SJ-H2.0
  rect 0.3x1.2 smd: 1(7.248,-1.083) 2(6.748,-1.083) 3(6.248,-1.083) 4(5.748,-1.083) 5(5.248,-1.083) 6(4.748,-1.083) 7(4.248,-1.083) 8(3.748,-1.083) 9(3.248,-1.083) 10(2.748,-1.083) 11(2.248,-1.083) 12(1.748,-1.083) 13(1.248,-1.083) 14(0.748,-1.083) 15(0.248,-1.083) 16(-0.252,-1.083) 17(-0.752,-1.083) 18(-1.25,-1.085) 19(-1.75,-1.085) 20(-2.25,-1.085) 21(-2.75,-1.085) 22(-3.25,-1.085) 23(-3.75,-1.085) 24(-4.25,-1.085) 25(-4.75,-1.085) 26(-5.25,-1.085) 27(-5.75,-1.085) 28(-6.25,-1.085) 29(-6.75,-1.085) 30(-7.25,-1.085)
  rect 2.2x3.3 smd: 31(8.85,1.085) 32(-8.85,1.085)
IND-SMD_L4.4-W4.2
  rect 1.4x2.12 smd: 1(2.028,0) 2(-2.028,0)
R0402
  rect 0.566x0.54 smd: 1(-0.433,0) 2(0.433,0)
SMA_L4.3-W2.6-LS5.2-RD
  rect 2x2 smd: 1(-2.2,0) 2(2.2,0)
SOT-23-3_L2.9-W1.6-P1.90-LS2.8-BR
  rect 1.07x0.6 smd: 1(1.235,-0.95) 2(1.235,0.95) 3(-1.235,0)
SOT-23-5_L3.0-W1.7-P0.95-LS2.8-BR
  rect 1.1x0.6 smd: 1(1.3,-0.95) 2(1.3,0) 3(1.3,0.95) 4(-1.3,0.95) 5(-1.3,-0.95)

## Nets
As in the schematic.

Pads without a net: FPC1 1 3 5 23; X3 4 5 7 8 19

## Via types
v1: diameter 0.61, hole 0.305, Top Layer to Bottom Layer, 21 vias

## Routing (per net, layer and track width the routed paths; a pad name or vN(x,y) marks a point on that pad's centre or on a via; arc(x,y) is an arc through that point)
GND: length 49.8
  Top Layer w0.254: X3.12 17.13,6 v1(17.89,5.24) 18.63,5.98 X3.9 ; X3.28 24.26,5.08 23.11,5.08 22.63,5.56 X3.1 ; X3.3 21.59,7.76 21.59,5.84 20.99,5.24 v1(20.33,5.24) 20.33,6.86 20.2,6.99 20.2,7.73 X3.6 ; FPC2.8 9.68,40.92 9.07,40.32 FPC2.6 ; v1(22.99,47.24) 22.99,46.48 22.98,46.48 FPC1.15 ; FPC1.18 21.48,42.49 v1(21.28,42.29) 20.32,42.29 19.98,42.63 FPC1.21 FPC1.22 ; FPC1.9 25.98,46.54 v1(25.27,47.24) 24.48,46.45 FPC1.12 ; FPC1.24 18.48,42.35 v1(18.54,42.29) ; FPC1.32 13.88,46.11 FPC1.30 FPC1.29 ; v1(28.14,47.24) 27.48,46.59 FPC1.6 ; X3.15 15.63,5.45 v1(15.42,5.24) 14.57,5.24 14.13,5.68 X3.18
  vias: v1(10.79,47.62)
VDD1.8: length 34.7
  Top Layer w0.254: v1(16.51,46.48) 16.98,46.01 FPC1.27
  Bottom Layer w0.254: v1(16.51,46.48) 7.75,46.48 6.51,45.25 C38.1 6.74,27.97 C39.1 7.05,25.98 U4.2
VDD2.8: length 38.7
  Top Layer w0.254: FPC2.5 7.49,40.33 7.49,44.07 7.87,44.45 11.43,44.45 13.59,42.29 v1(16.51,42.29) 16.51,44.48 FPC1.28
  Bottom Layer w0.254: v1(16.51,42.29) 16.51,41.4 15.75,40.64 12.95,40.64 11.59,39.28 C6.1 11.88,27.79 C30.1 12,26.04 U1.2
VDD5: length 63.7
  Top Layer w0.254: X3.26 X3.25 10.67,7.84 10.67,9.02
  Top Layer w0.8: v1(10.63,14.48) 10.67,14.44 10.67,9.02
  PWR w0.8: v1(10.63,14.48) 22.61,14.48 23.11,13.97 v1(23.11,10.03) 27.31,10.03 30.73,13.46 v1(30.73,24.26)
  Bottom Layer w0.5: L1.2 31.62,25.14 v1(30.73,24.26)
  Bottom Layer w0.8: U4.3 U1.3 11.05,14.89 v1(10.63,14.48) ; C35.1 24.7,10.8 23.94,10.03 v1(23.11,10.03) ; 24.65,14.16 24.65,12.27 24.64,12.26
BL_GND: length 34.1
  Top Layer w0.254: v1(29.72,42.67) 29.72,43.31 29.46,43.56 29.46,44.49 FPC1.2
  Bottom Layer w0.5: U3.3 25.12,22.38 R4.1 32.06,22.4 33.02,23.37 33.02,41.91 32.26,42.67 v1(29.72,42.67)
BL_VCC: length 17.9
  Top Layer w0.254: FPC1.4 28.48,43.02 v1(28.38,42.93)
  Bottom Layer w0.254: 28.32,31.31 28.38,31.24
  Bottom Layer w0.5: C37.1 v1(28.38,42.93) ; D1.1 28.22,31.41
LCD_BL: length 43.8
  Top Layer w0.254: v1(20.95,18.42) 27.94,18.42 28.83,17.53 28.83,4.83 27.56,3.56 13.59,3.56 13.13,4.01 X3.20
  Bottom Layer w0.254: R2.1 R3.2 19.86,18.42 v1(20.95,18.42)
MIPI_CLN: length 46.5
  Top Layer w0.203: X3.13 16.63,8.71 16.55,8.79 16.55,18.32 arc(16.37,18.75) 15.94,18.93 arc(15.74,19.01) 15.66,19.21 15.66,20.17 arc(15.74,20.37) 15.94,20.45 arc(16.37,20.63) 16.55,21.06 16.55,22.02 arc(16.37,22.45) 15.94,22.63 arc(15.74,22.71) 15.66,22.91 15.66,23.87 arc(15.74,24.07) 15.94,24.15 arc(16.37,24.33) 16.55,24.76 16.55,25.72 arc(16.37,26.15) 15.94,26.33 arc(15.74,26.41) 15.66,26.61 15.66,27.57 arc(15.74,27.77) 15.94,27.86 arc(16.37,28.03) 16.55,28.46 16.55,37.37 17.03,37.86 23.21,37.86 23.95,38.6 23.95,43.36 23.89,43.42 23.89,43.62 23.98,43.71 FPC1.13
MIPI_CLP: length 46.5
  Top Layer w0.203: FPC1.14 23.48,43.71 23.57,43.62 23.57,43.28 23.62,43.23 23.62,38.73 23.08,38.19 16.9,38.19 16.22,37.51 16.22,28.46 arc(16.14,28.26) 15.94,28.18 arc(15.51,28) 15.33,27.57 15.33,26.61 arc(15.51,26.18) 15.94,26 arc(16.14,25.92) 16.22,25.72 16.22,24.76 arc(16.14,24.56) 15.94,24.48 arc(15.51,24.3) 15.33,23.87 15.33,22.91 arc(15.51,22.48) 15.94,22.3 arc(16.14,22.22) 16.22,22.02 16.22,21.06 arc(16.14,20.86) 15.94,20.78 arc(15.51,20.6) 15.33,20.17 15.33,19.21 arc(15.51,18.78) 15.94,18.6 arc(16.14,18.52) 16.22,18.32 16.22,8.79 16.13,8.71 X3.14
MIPI_D0N: length 46.7
  Top Layer w0.203: X3.10 18.13,8.71 18.05,8.79 18.05,10.85 arc(18.14,11.09) 18.38,11.19 arc(18.85,11.38) 19.04,11.85 19.04,12.7 arc(18.85,13.17) 18.38,13.37 arc(18.14,13.46) 18.05,13.7 18.05,14.56 arc(18.14,14.79) 18.38,14.89 arc(18.85,15.08) 19.04,15.55 19.04,16.41 arc(18.85,16.87) 18.38,17.07 arc(18.14,17.17) 18.05,17.4 18.05,35.11 18.9,35.96 25.76,35.96 26.89,37.1 26.89,43.62 26.98,43.71 FPC1.7
MIPI_D0P: length 46.7
  Top Layer w0.203: X3.11 17.63,8.71 17.72,8.79 17.72,10.85 arc(17.91,11.32) 18.38,11.51 arc(18.62,11.61) 18.72,11.85 18.72,12.7 arc(18.62,12.94) 18.38,13.04 arc(17.91,13.23) 17.72,13.7 17.72,14.56 arc(17.91,15.02) 18.38,15.22 arc(18.62,15.31) 18.72,15.55 18.72,16.41 arc(18.62,16.64) 18.38,16.74 arc(17.91,16.93) 17.72,17.4 17.72,35.25 18.76,36.29 25.62,36.29 26.57,37.23 26.57,43.62 26.48,43.71 FPC1.8
MIPI_D1N: length 46.8
  Top Layer w0.203: FPC1.10 25.48,43.86 25.5,43.84 25.5,43.59 v1(25.91,43.18) ; X3.16 15.13,8.71 15.05,8.79 15.05,9.33 v1(15.37,9.65)
  Bottom Layer w0.203: v1(25.91,43.18) 25.47,42.75 25.47,40.25 24.87,39.65 16.11,39.65 15.09,38.63 15.09,9.93 v1(15.37,9.65)
MIPI_D1P: length 46.8
  Top Layer w0.203: X3.17 14.63,8.71 14.72,8.79 14.72,9.41 v1(14.48,9.65) ; v1(24.76,43.18) 25.17,43.59 25.17,43.7 24.98,43.9 FPC1.11
  Bottom Layer w0.203: v1(24.76,43.18) 25.15,42.8 25.15,40.39 24.73,39.97 15.97,39.97 14.76,38.76 14.76,9.93 v1(14.48,9.65)
MIPI_RST: length 76.2
  Top Layer w0.254: FPC1.26 17.53,44.55 17.53,49.28 18.8,50.55 31.88,50.55 33.53,48.9 33.53,34.54 32.77,33.78 21.08,33.78 20.32,33.02 20.32,12.19 22.13,10.38 X3.2
SCL: length 46.6
  Top Layer w0.254: X3.23 11.63,3.51 11.05,2.92 7.24,2.92 6.48,3.68 FPC2.3
SDA: length 48.4
  Top Layer w0.254: FPC2.2 5.98,3.29 6.86,2.41 11.3,2.41 12.06,3.17 12.06,7.73 X3.22
TP_INT: length 44.8
  Top Layer w0.254: FPC2.4 6.91,40.25 6.91,4 7.48,3.43 10.41,3.43 11.13,4.15 X3.24
TP_RST: length 50.4
  Top Layer w0.254: FPC2.1 5.48,3.03 6.73,1.78 11.68,1.78 12.56,2.66 12.56,7.73 X3.21
$1N1393: length 7.2
  Bottom Layer w0.8: 24.58,15.1 C36.1 24.7,17.02 24.7,17.97 24.38,18.29 22.35,18.29 21.66,18.98 21.66,19.66 U3.5
$1N1536: length 6.6
  Bottom Layer w0.254: U3.4 23.43,20.64 22.99,21.08 19.05,21.08 18.87,20.9 R2.2
$1N1811: length 10.3
  Bottom Layer w0.5: U3.1 21.46,22.45 21.46,24.38 21.84,24.77 23.11,24.77 23.62,25.27 D1.2 23.66,27.05 L1.1

## Copper pours and planes (outline as drawn; the poured copper is in the pictures)
GND on Top Layer: -5.72,57.28 37.72,57.28 37.72,-3.81 -5.72,-3.81
GND on Bottom Layer: -1.27,53.98 38.23,53.98 38.23,-3.3 -1.27,-3.3
GND on GND: -5.72,56.64 39.88,56.64 39.88,-5.84 -5.72,-5.84
GND on PWR: -0.64,54.74 38.48,54.74 38.48,-2.54 -0.64,-2.54

## Text on the board
Top Silkscreen Layer: mipi test board | Author: myry
